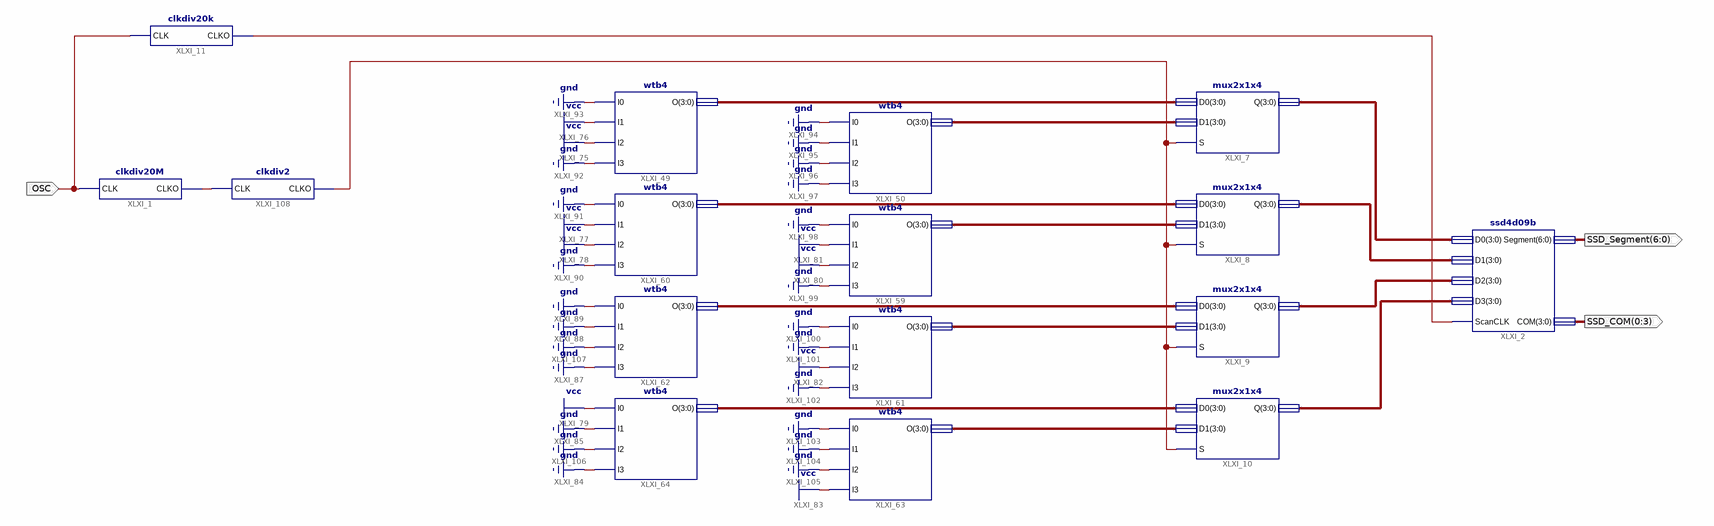
[diagram p0: schematic sheet 1]
// Xilinx ISE schematic main.sch (spartan6) as structural Verilog: 16 symbols, 3 ports
module main (
  input  OSC,
  output [6:0] SSD_Segment,
  output [0:3] SSD_COM
);

  wire XLXN_14, XLXN_113, XLXN_114;
  wire [3:0] XLXN_9, XLXN_10, XLXN_11, XLXN_12, XLXN_58, XLXN_59, XLXN_60, XLXN_61, XLXN_62, XLXN_63,
       XLXN_64, XLXN_65;

  clkdiv20k XLXI_11 (.CLK(OSC), .CLKO(XLXN_14));
  clkdiv20M XLXI_1 (.CLK(OSC), .CLKO(XLXN_113));
  mux2x1x4 XLXI_8 (.D0(XLXN_60), .D1(XLXN_61), .S(XLXN_114), .Q(XLXN_10));
  mux2x1x4 XLXI_9 (.D0(XLXN_62), .D1(XLXN_63), .S(XLXN_114), .Q(XLXN_11));
  mux2x1x4 XLXI_10 (.D0(XLXN_64), .D1(XLXN_65), .S(XLXN_114), .Q(XLXN_12));
  mux2x1x4 XLXI_7 (.D0(XLXN_58), .D1(XLXN_59), .S(XLXN_114), .Q(XLXN_9));
  ssd4d09b XLXI_2 (
    .D0(XLXN_9), .D1(XLXN_10), .D2(XLXN_11), .D3(XLXN_12), .ScanCLK(XLXN_14), .Segment(SSD_Segment),
    .COM(SSD_COM));
  wtb4 XLXI_49 (.I0(1'b0), .I1(1'b1), .I2(1'b1), .I3(1'b0), .O(XLXN_58));
  wtb4 XLXI_50 (.I0(1'b0), .I1(1'b0), .I2(1'b0), .I3(1'b0), .O(XLXN_59));
  wtb4 XLXI_59 (.I0(1'b0), .I1(1'b1), .I2(1'b1), .I3(1'b0), .O(XLXN_61));
  wtb4 XLXI_60 (.I0(1'b0), .I1(1'b1), .I2(1'b1), .I3(1'b0), .O(XLXN_60));
  wtb4 XLXI_61 (.I0(1'b0), .I1(1'b0), .I2(1'b1), .I3(1'b0), .O(XLXN_63));
  wtb4 XLXI_62 (.I0(1'b0), .I1(1'b0), .I2(1'b0), .I3(1'b0), .O(XLXN_62));
  wtb4 XLXI_63 (.I0(1'b0), .I1(1'b0), .I2(1'b0), .I3(1'b1), .O(XLXN_65));
  wtb4 XLXI_64 (.I0(1'b1), .I1(1'b0), .I2(1'b0), .I3(1'b0), .O(XLXN_64));
  clkdiv2 XLXI_108 (.CLK(XLXN_113), .CLKO(XLXN_114));
endmodule
